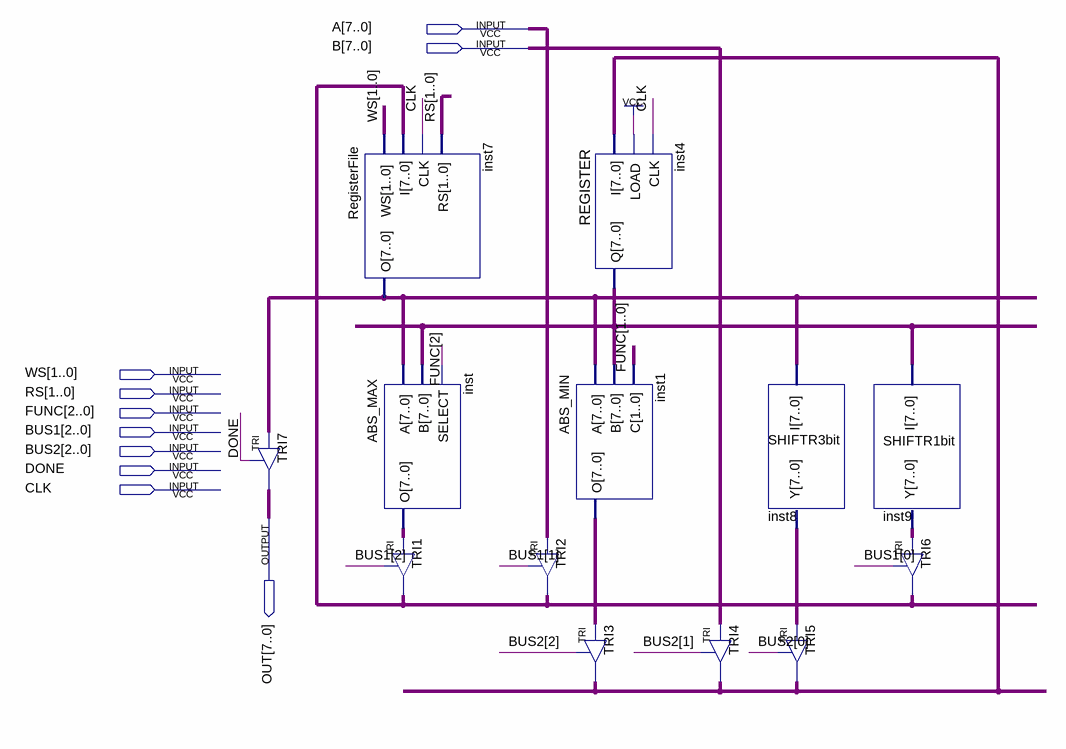
[diagram p0: schematic sheet]
// Quartus schematic DATAPATH.bdf as structural Verilog: 13 symbols, 10 pins
module DATAPATH (
  input  [7:0] A,
  input  [7:0] B,
  input  [1:0] WS,
  input  [1:0] RS,
  input  [2:0] FUNC,
  input  [2:0] BUS1,
  input  [2:0] BUS2,
  input  DONE,
  input  CLK,
  output [7:0] OUT
);

  wire [7:0] inst1_o, inst4_q, inst7_o, inst8_y, inst9_y, inst_o, TRI1_out, TRI3_out;

  TRI TRI7[7:0] (.IN(inst7_o), .OE(DONE), .OUT(OUT));
  RegisterFile inst7 (.WS(WS), .I(TRI1_out), .CLK(CLK), .RS(RS), .O(inst7_o));
  ABS_MAX inst (.A(inst7_o), .B(inst4_q), .SELECT(FUNC[2]), .O(inst_o));
  TRI TRI1[7:0] (.IN(inst_o), .OE(BUS1[2]), .OUT(TRI1_out));
  ABS_MIN inst1 (.A(inst7_o), .B(inst4_q), .C(FUNC[1:0]), .O(inst1_o));
  TRI TRI2[7:0] (.IN(A), .OE(BUS1[1]), .OUT(TRI1_out));
  REGISTER inst4 (.I(TRI3_out), .LOAD(1'b1), .CLK(CLK), .Q(inst4_q));
  TRI TRI3[7:0] (.IN(inst1_o), .OE(BUS2[2]), .OUT(TRI3_out));
  TRI TRI4[7:0] (.IN(B), .OE(BUS2[1]), .OUT(TRI3_out));
  SHIFTR3bit inst8 (.I(inst7_o), .Y(inst8_y));
  TRI TRI5[7:0] (.IN(inst8_y), .OE(BUS2[0]), .OUT(TRI3_out));
  SHIFTR1bit inst9 (.I(inst4_q), .Y(inst9_y));
  TRI TRI6[7:0] (.IN(inst9_y), .OE(BUS1[0]), .OUT(TRI1_out));
endmodule
